# EAGLE design SMPSv2 (EAGLE 6.4)
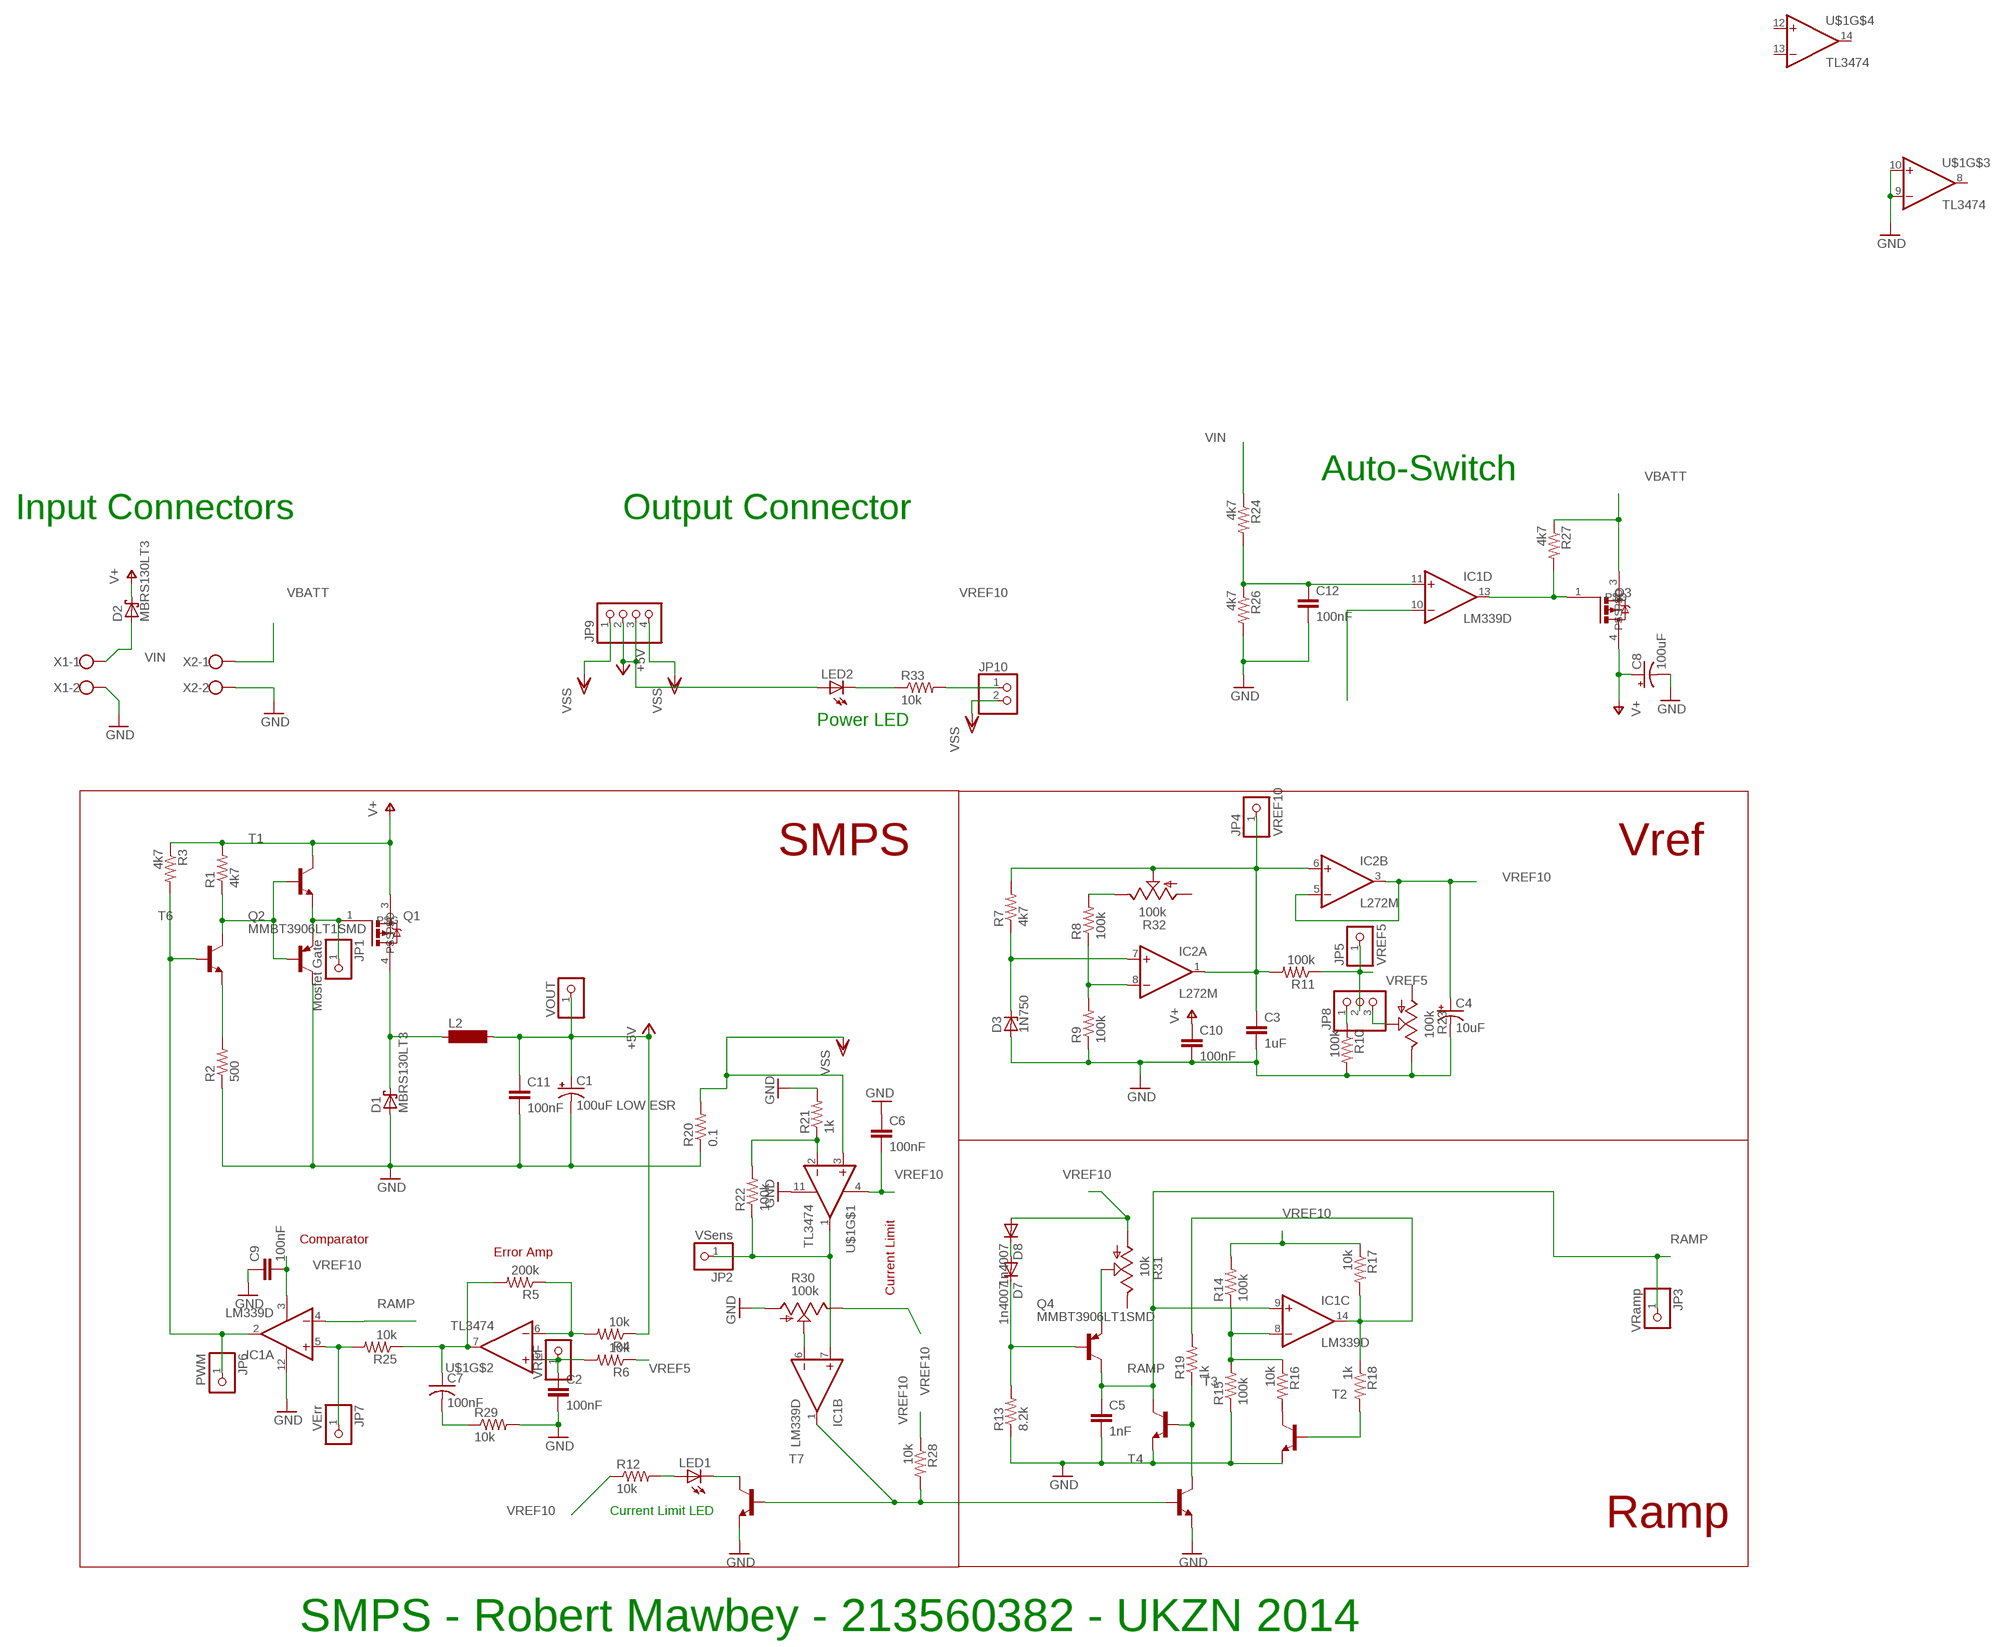
[diagram p0: schematic, sheet 1]

## Parts
C1  100uF LOW ESR  CPOL-USD  [PANASONIC_D]
C2  100nF  C-EUC0805  [C0805]
C3  1uF  C-EUC0805  [C0805]
C4  10uF  CPOL-USE5-10.5  [E5-10,5]
C5  1nF  C-EUC0805  [C0805]
C6  100nF  C-EUC0805  [C0805]
C7  100nF  C-USC0805  [C0805]
C8  100uF  CPOL-USE5-13  [E5-13]
C9  100nF  C-EUC0805  [C0805]
C10  100nF  C-EUC0805  [C0805]
C11  100nF  C-EUC0805  [C0805]
C12  100nF  C-EUC0805  [C0805]
D1  MBRS130LT3  [SMB]
D2  MBRS130LT3  [SMB]
D3  1N750  ZENER-DIODEZD-7.5  [ZDIO-7.5]
D7  1n4007  DIODE-DO-214AC  [DO-214AC]
D8  1n4007  DIODE-DO-214AC  [DO-214AC]
IC1  LM339D  [SO14]
IC2  L272M  [DIL08]
JP1  Mosfet Gate  PINHD-1X1  [1X01]
JP2  VSens  PINHD-1X1  [1X01]
JP3  VRamp  PINHD-1X1  [1X01]
JP4  VREF10  PINHD-1X1  [1X01]
JP5  VREF5  PINHD-1X1  [1X01]
JP6  PWM  PINHD-1X1  [1X01]
JP7  VErr  PINHD-1X1  [1X01]
JP8  PINHD-1X3  [1X03]
JP9  PINHD-1X4  [1X04]
JP10  PINHD-1X2  [1X02]
L2  BS11  [BS11]
LED1  LEDCHIPLED_0805  [CHIPLED_0805]
LED2  LEDCHIPLED_0805  [CHIPLED_0805]
Q1  IRFR9024NDPAK  [D-PAK_TO252AA]
Q2  MMBT3906LT1SMD  [SOT23-BEC]
Q3  IRFR9024NDPAK  [D-PAK_TO252AA]
Q4  MMBT3906LT1SMD  [SOT23-BEC]
R1  4k7  R-US_R0805  [R0805]
R2  500  R-US_R0805  [R0805]
R3  4k7  R-US_R0805  [R0805]
R4  10k  R-US_R0805  [R0805]
R5  200k  R-US_R0805  [R0805]
R6  10k  R-US_R0805  [R0805]
R7  4k7  R-US_R0805  [R0805]
R8  100k  R-US_R0805  [R0805]
R9  100k  R-US_R0805  [R0805]
R10  100k  R-US_R0805  [R0805]
R11  100k  R-US_R0805  [R0805]
R12  10k  R-US_R0805  [R0805]
R13  8.2k  R-US_R0805  [R0805]
R14  100k  R-US_R0805  [R0805]
R15  100k  R-US_R0805  [R0805]
R16  10k  R-US_R0805  [R0805]
R17  10k  R-US_R0805  [R0805]
R18  1k  R-US_R0805  [R0805]
R19  1k  R-US_R0805  [R0805]
R20  0.1  R-US_R1206  [R1206]
R21  1k  R-US_R0805  [R0805]
R22  100k  R-US_R0805  [R0805]
R23  100k  TRIM_US-B25P  [B25P]
R24  4k7  R-US_R0805  [R0805]
R25  10k  R-US_R0805  [R0805]
R26  4k7  R-US_R0805  [R0805]
R27  4k7  R-US_R0805  [R0805]
R28  10k  R-US_R0805  [R0805]
R29  10k  R-US_R0805  [R0805]
R30  100k  TRIM_US-B25P  [B25P]
R31  10k  TRIM_US-B25P  [B25P]
R32  100k  TRIM_US-B25P  [B25P]
R33  10k  R-US_R0805  [R0805]
T1  MMBT2222ALT1-NPN-SOT23-BEC  [SOT23-BEC]
T2  MMBT2222ALT1-NPN-SOT23-BEC  [SOT23-BEC]
T3  MMBT2222ALT1-NPN-SOT23-BEC  [SOT23-BEC]
T4  MMBT2222ALT1-NPN-SOT23-BEC  [SOT23-BEC]
T6  MMBT2222ALT1-NPN-SOT23-BEC  [SOT23-BEC]
T7  MMBT2222ALT1-NPN-SOT23-BEC  [SOT23-BEC]
U$1  TL3474  [SO14]
VOUT  PINHD-1X1  [1X01]
VREF  PINHD-1X1  [1X01]
X1  W237-102  [W237-102]
X2  W237-102  [W237-102]

## Nets
+5V: C1.+ C11.1 JP9.2 JP9.3 L2.2 LED2.A R4.1 VOUT.1
GND: C1.- C2.2 C3.2 C4.- C5.2 C6.1 C8.- C9.1 C10.2 C11.2 C12.2 D1.A D3.A IC1.12(P:GND) Q2.C R2.1 R9.1 R10.2 R13.1 R15.1 R20.1 R21.2 R23.E R26.2 R29.2 R30.A T2.E T3.E T4.E T7.E U$1.9(-IN) U$1.10(+IN) U$1.11(V-) X1.2 X2.2
MSOUT: D1.C L2.1 Q1.4(P$D)
N$1: JP1.1 Q1.1(P$G) Q2.E T1.E
N$2: C7.2 R29.1
N$3: IC1.2(A:OUT) JP6.1 R3.2 T6.B
N$4: C2.1 R6.2 U$1.5(+IN) VREF.1
N$5: Q4.E R31.S
N$6: C12.1 IC1.11(D:+IN) R24.2 R26.1
N$7: C7.1 R5.2 R25.1 U$1.7(OUT)
N$8: D3.C IC2.7(A:+IN) R7.1
N$9: R4.2 R5.1 U$1.6(-IN)
N$10: IC2.8(A:-IN) R8.1 R9.2
N$12: IC1.13(D:OUT) Q3.1(P$G) R27.2
N$13: LED1.C T7.C
N$14: D7.C Q4.B R13.2
N$15: R19.1 T3.B T4.C
N$16: D7.A D8.C
N$17: R16.2 T2.C
N$18: IC1.8(C:-IN) R14.1 R15.2 R16.1
N$19: R21.1 R22.2 U$1.2(-IN)
N$20: R18.2 T2.B
N$21: IC1.6(B:-IN) R30.S
N$22: IC1.7(B:+IN) JP2.1 R22.1 U$1.1(OUT)
N$23: R8.2 R32.E
N$24: IC1.1(B:OUT) R28.2 T4.B T7.B
N$25: IC1.5(A:+IN) JP7.1 R25.2
N$26: LED1.A R12.2
N$27: JP8.3 R23.S
N$28: IC1.14(C:OUT) R17.2 R18.1 R19.2
N$29: Q2.B R1.1 T1.B T6.C
N$30: R2.2 T6.E
N$31: JP8.1 R10.1
N$32: LED2.C R33.1
N$33: JP10.1 R33.2
RAMP: C5.1 IC1.4(A:-IN) IC1.9(C:+IN) JP3.1 Q4.C T3.C
V+: C8.+ C10.1 D2.C Q1.3(P$S) Q3.4(P$D) R1.2 R3.1 T1.C
VBATT: Q3.3(P$S) R27.1 X2.1
VIN: D2.A R24.1 X1.1
VR10: C3.1 IC2.1(A:OUT) IC2.6(B:+IN) JP4.1 R7.2 R11.2 R32.S
VREF5: JP5.1 JP8.2 R6.1 R11.1
VREF10: C4.+ C6.2 C9.2 D8.A IC1.3(P:V+) IC1.10(D:-IN) IC2.3(B:OUT) IC2.5(B:-IN) R12.1 R14.2 R17.1 R28.1 R30.E R31.A U$1.4(V+)
VSS: JP9.1 JP9.4 JP10.2 R20.2 U$1.3(+IN)
Unconnected: R23.A R31.E R32.A U$1.8(OUT) U$1.12(+IN) U$1.13(-IN) U$1.14(OUT)

## Notes on the sheet
- Auto-Switch
- Input Connectors | Output Connector
- Power LED
- SMPS | Vref
- Comparator
- Error Amp
- Current Limit
- Current Limit LED
- Ramp
- SMPS - Robert Mawbey - 213560382 - UKZN 2014

## Power pins joined to a net without a drawn wire
GND: IC2.4(P:GND)
V+: IC2.2(P:V+)

## Library data of the parts
C1 C4 C8 = resistor:CPOL-US: POLARIZED CAPACITOR, American symbol
C2 C3 C5 C6 C9-C12 = resistor:C-EU: CAPACITOR, European symbol
C7 = resistor:C-US: CAPACITOR, American symbol
D1 D2 = diode:MBRS130LT3: Schottky Power Rectifier Source: http://www.onsemi.com/pub/Collateral/MBRS130LT3-D.PDF
D3 = diode:ZENER-DIODE: Z-Diode
D7 D8 = diode:DIODE-: DIODE
IC1 = linear:LM339: Low Power Low Offset Voltage Quad Comparators with open collector; LM139/LM239/LM339/LM2901/LM3302
IC2 = linear:L272: OP AMP
JP1-JP7 VOUT VREF = pinhead:PINHD-1X1: PIN HEADER
JP8 = pinhead:PINHD-1X3: PIN HEADER
JP9 = pinhead:PINHD-1X4: PIN HEADER
JP10 = pinhead:PINHD-1X2: PIN HEADER
L2 = inductor-neosid:BS: INDUCTOR nominal inductance, magnetically screened; OC_FARNELL: unknown; OC_NEWARK: unknown
LED1 LED2 = led:LED: LED OSRAM: - CHIPLED LG R971, LG N971, LY N971, LG Q971, LY Q971, LO R971, LY R971 LH N974, LH R974 LS Q976, LO Q976, LY Q976 LO Q996 - Hyper CHIPLED LW Q18S LB Q993, LB Q99A, LB R99A - SideLED LS A670, LO A670, LY A670, LG A670, LP A670 LB A673, LV A673, LT A673, LW A673 LH A674 LY A675 LS A676, LA A676, LO A676, LY A676, LW A676 LS A679, LY A679, LG A679 - Hyper Micro SIDELED® LS Y876, LA Y876, LO Y876, LY Y876 LT Y87S - SmartLED LW L88C, LW L88S LB L89C, LB L89S, LG L890 LS L89K, LO L89K, LY L89K LS L896, LA L896, LO L896, LY L896 - TOPLED LS T670, LO T670, LY T670, LG T670, LP T670 LSG T670, LSP T670, LSY T670, LOP T670, LYG T670 LG T671, LOG T671, LSG T671 LB T673, LV T673, LT T673, LW T673 LH T674 LS T676, LA T676, LO T676, LY T676, LB T676, LH T676, LSB T676, LW T676 LB T67C, LV T67C, LT T67C, LS T67K, LO T67K, LY T67K, LW E67C LS E67B, LA E67B, LO E67B, LY E67B, LB E67C, LV E67C, LT E67C LW T67C LS T679, LY T679, LG T679 LS T770, LO T770, LY T770, LG T770, LP T770 LB T773, LV T773, LT T773, LW T773 LH T774 LS E675, LA E675, LY E675, LS T675 LS T776, LA T776, LO T776, LY T776, LB T776 LHGB T686 LT T68C, LB T68C - Hyper Mini TOPLED® LB M676 - Mini TOPLED Santana® LG M470 LS M47K, LO M47K, LY M47K Source: http://www.osram.convergy.de LUXEON: - LUMILED® LXK2-PW12-R00, LXK2-PW12-S00, LXK2-PW14-U00, LXK2-PW14-V00 LXK2-PM12-R00, LXK2-PM12-S00, LXK2-PM14-U00 LXK2-PE12-Q00, LXK2-PE12-R00, LXK2-PE12-S00, LXK2-PE14-T00, LXK2-PE14-U00 LXK2-PB12-K00, LXK2-PB12-L00, LXK2-PB12-M00, LXK2-PB14-N00, LXK2-PB14-P00, LXK2-PB14-Q00 LXK2-PR12-L00, LXK2-PR12-M00, LXK2-PR14-Q00, LXK2-PR14-R00 LXK2-PD12-Q00, LXK2-PD12-R00, LXK2-PD12-S00 LXK2-PH12-R00, LXK2-PH12-S00 LXK2-PL12-P00, LXK2-PL12-Q00, LXK2-PL12-R00 Source: www.luxeon.com KINGBRIGHT: KA-3528ASYC Source: www.kingbright.com
Q1 Q3 = RobThePyro:IRFR9024N: http://www.irf.com/product-info/datasheets/data/irfr9024n.pdf
Q2 Q4 = transistor-pnp:MMBT3906*: PNP Transistror
R1-R22 R24-R29 R33 = resistor:R-US_: RESISTOR, American symbol
R23 R30-R32 = pot:TRIM_US-: POTENTIOMETER
T1-T4 T6 T7 = transistor:*-NPN-: NPN Transistror BF959 corrected 2008.03.06
U$1 = linear:TL3474
X1 X2 = con-wago-500:W237-102: WAGO SCREW CLAMP; MPN: 237-102; OC_FARNELL: unknown; OC_NEWARK: 70K9898

## Board
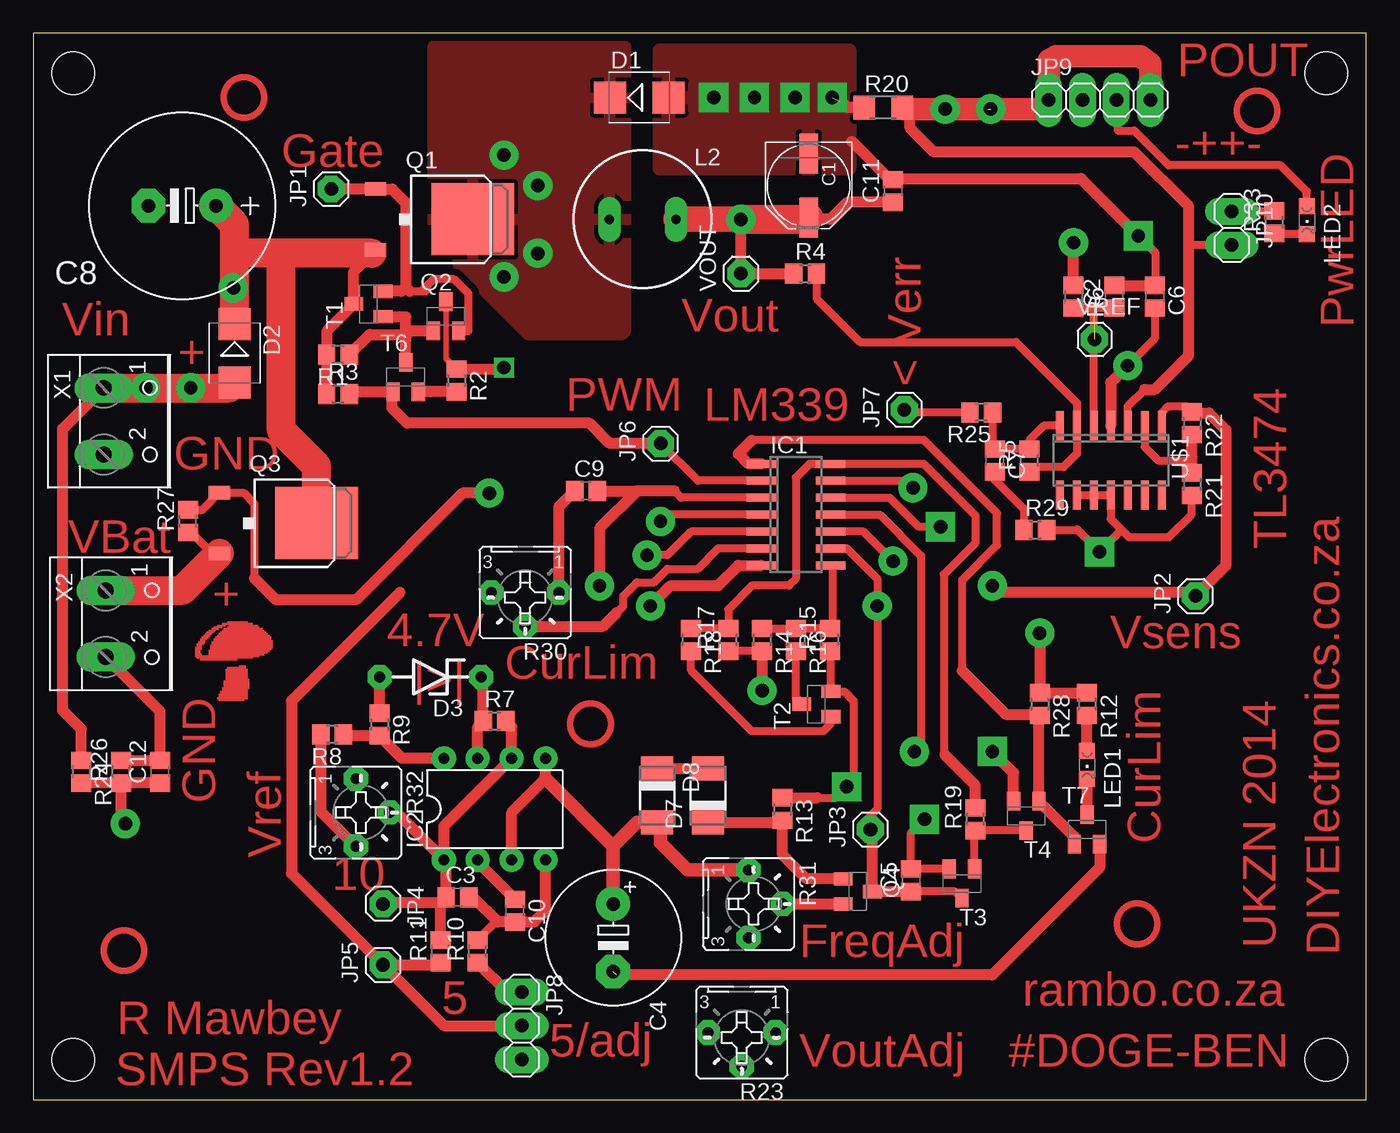
[diagram p1: board, top side]
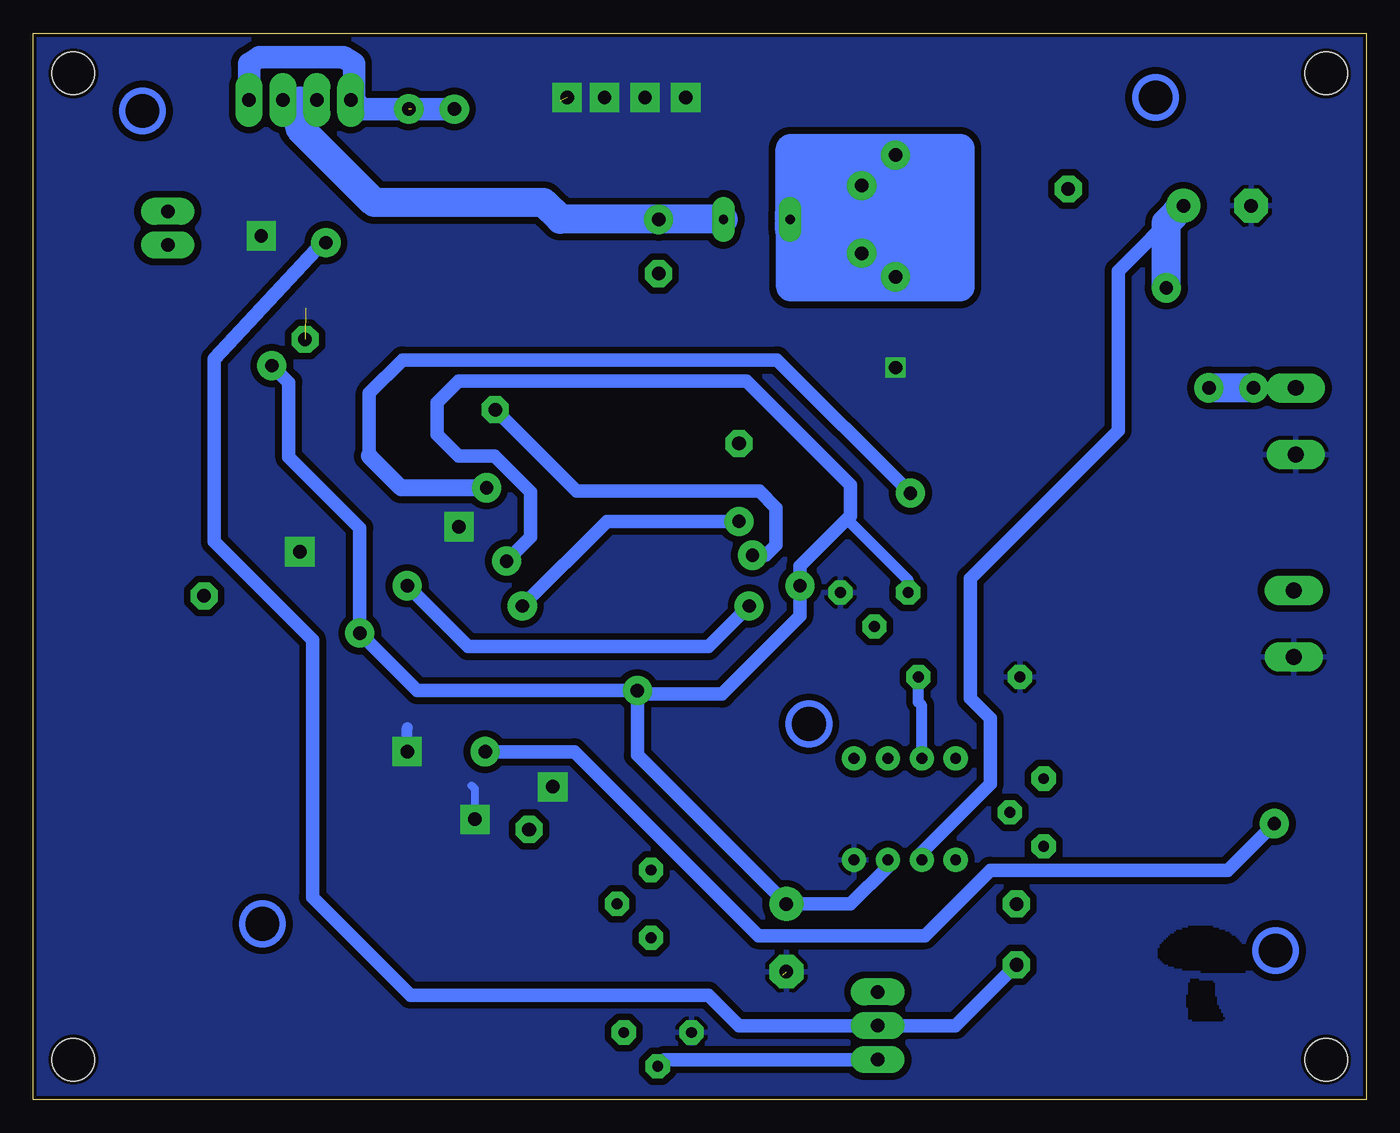
[diagram p2: board, bottom side, seen from below]

Size 100 x 80 mm. Coordinates in mm from the lower left corner, seen from the top.
Outline: 0,0 100,0 100,80 0,80 0,0
Copper layers (1*16): Top 0.035mm / dielectric 1.5mm / Bottom 0.035mm
Design rules "SparkFun *": minimum track width 16mil, minimum drill 0.7mm, track to track 20mil, track to pad 12mil, pad to pad 12mil, via to via 10mil, smd to smd 12mil, copper to edge 10mil, drill to drill 8mil, minimum pad ring 0.5mm, minimum via ring 10mil, stop-mask expansion 4mil, vias tented up to drill 25mil, thermal gap 12mil
Holes 3.2 mm at 3,3 97,3 97,77 3,77
bRestrict: area 10.7,5.9 to 13,6; area 10.6,6 to 13.3,6.2; area 10.7,6.2 to 13.3,6.3; area 10.7,6.3 to 13.3,6.5; area 10.9,6.5 to 13.3,6.6; area 10.9,6.6 to 13.3,6.8; area 11,6.8 to 13.3,6.9; area 11,6.9 to 13.5,7.1; area 11.2,7.1 to 13.5,7.2; area 11.2,7.2 to 13.5,7.4; area 11.2,7.4 to 13.5,7.5; area 11.2,7.5 to 13.5,7.7; 50 more areas

### Footprints (pad centres in the part's own frame; a part is rotated, then mirrored left to right if it is on the bottom)
PANASONIC_D = smd 3 x 1.4: + 2.4,0; - -2.4,0
C0805 = smd 1.3 x 1.5: 1 -0.85,0; 2 0.85,0
E5-10,5 = drill 1.016 pad 2.54: + -2.54,0 | drill 1.016 pad 2.54 octagon: - 2.54,0
E5-13 = drill 1.016 pad 2.54: + -2.54,0 | drill 1.016 pad 2.54 octagon: - 2.54,0
SMB = smd 2.4 x 2.4: A 2.2,0; C -2.2,0
ZDIO-7.5 = drill 0.813 octagon: A 3.81,0; C -3.81,0
DO-214AC = smd 1.8 x 2.4: A 2.025,0; C -2.025,0
SO14 = smd 0.6 x 2.2: 1 -3.81,-2.6; 2 -2.54,-2.6; 3 -1.27,-2.6; 4 0,-2.6; 5 1.27,-2.6; 6 2.54,-2.6; 7 3.81,-2.6; 8 3.81,2.6; 9 2.54,2.6; 10 1.27,2.6; 11 0,2.6; 12 -1.27,2.6; 13 -2.54,2.6; 14 -3.81,2.6
DIL08 = drill 0.813 pad 1.27: 1 -3.81,-3.81; 2 -1.27,-3.81; 3 1.27,-3.81; 4 3.81,-3.81; 5 3.81,3.81; 6 1.27,3.81; 7 -1.27,3.81; 8 -3.81,3.81
1X01 = drill 1.016 octagon: 1 0,0
1X03 = drill 1.016 long: 1 -2.54,0; 2 0,0; 3 2.54,0
1X04 = drill 1.016 long: 1 -3.81,0; 2 -1.27,0; 3 1.27,0; 4 3.81,0
1X02 = drill 1.016 long: 1 -1.27,0; 2 1.27,0
BS11 = drill 0.7 long: 1 -2.5,0; 2 2.5,0
CHIPLED_0805 = smd 1.2 x 1.2: A 0,-1.05; C 0,1.05
D-PAK_TO252AA = smd 1 x 1.6: 1 -2.28,-4.8; 3 2.28,-4.8 | smd 5.4 x 6.2: 4 0,2.5
SOT23-BEC = smd 1 x 1.4: B -0.95,-1.1; C 0,1.1; E 0.95,-1.1
R0805 = smd 1.3 x 1.5: 1 -0.85,0; 2 0.85,0
R1206 = smd 1.6 x 1.803: 1 -1.422,0; 2 1.422,0
B25P = drill 0.813 octagon: A -2.54,0; E 2.54,0; S 0,2.54
W237-102 = drill 1.194 long: 1 -2.5,-1.27; 2 2.5,-1.27

### Placement (x,y rotation side)
C1  58.17,68.58 270 top
C2  81.09,60.24 90 top
C3  31.82,15.19 0 top
C4  43.5,12.14 270 top
C5  65.85,16.46 90 top
C6  84.14,60.24 270 top
C7  72.13,47.95 270 top
C8  11.18,67.06 180 top
C9  41.47,45.67 0 top
C10  36.14,14.17 270 top
C11  64.5,68.17 90 top
C12  9.5,24.6 90 top
D1  45.47,75.18 0 top
D2  15.1,56 270 top
D3  29.79,31.7 180 top
D7  50.61,22.81 90 top
D8  46.8,22.81 270 top
IC1  57.22,43.89 270 top
IC2  34.61,21.79 0 top
JP1  22.35,68.33 90 top
JP2  87.19,37.79 90 top
JP3  62.81,20.27 90 top
JP4  26.23,14.68 270 top
JP5  26.23,10.11 90 top
JP6  47.06,49.22 90 top
JP7  65.35,51.76 90 top
JP8  36.64,5.53 270 top
JP9  80,75 0 top
JP10  89.92,65.38 270 top
L2  45.72,66.04 0 top
LED1  79.06,25.09 180 top
LED2  95.55,65.99 180 top
Q1  30.48,66.04 270 top
Q2  30.95,58.77 0 top
Q3  18.75,43.25 270 top
Q4  61.86,15.61 270 top
R1  22.86,55.88 180 top
R2  31.75,53.96 270 top
R3  22.86,52.94 0 top
R4  57.91,61.98 0 top
R5  74.74,47.95 90 top
R6  78.05,60.24 270 top
R7  34.61,28.39 0 top
R8  22.42,27.38 180 top
R9  25.98,28.14 270 top
R10  33.34,11.12 90 top
R11  30.55,11.12 90 top
R12  79.06,29.66 270 top
R13  56.2,21.79 270 top
R14  54.68,34.49 270 top
R15  59.76,34.49 90 top
R16  57.22,34.49 270 top
R17  52.14,34.49 90 top
R18  49.34,34.49 270 top
R19  70.68,21.03 90 top
R20  63.75,74.42 0 top
R21  86.94,46.17 270 top
R22  86.94,50.75 270 top
R23  53.15,5.03 180 top
R24  3.6,24.6 270 top
R25  71.12,51.56 180 top
R26  6.6,24.6 90 top
R27  11.6,43.4 90 top
R28  75.51,29.66 270 top
R29  75.17,42.73 0 top
R30  36.9,38.05 180 top
R31  53.66,14.68 270 top
R32  24.2,21.54 270 top
R33  93.12,65.84 90 top
T1  25.15,59.69 90 top
T2  58.74,29.66 90 top
T3  69.66,16.2 180 top
T4  74.49,21.28 180 top
T6  27.94,54.21 0 top
T7  79.06,20.27 0 top
U$1  80.84,47.95 180 top
VOUT  53.09,61.98 90 top
VREF  79.62,57.04 0 top
X1  6.55,50.9 270 top
X2  6.7,35.7 270 top

### Tracks (layer width: path | path; a pad name or v marks a point on that pad's centre or on a via)
+5V  (via drill 1 pad 2.18)
  Top 0.61: LED2.A 95.56,68.12 93.57,70.1 85.19,70.1 82.6,72.69 81.38,72.69 81.38,74.89 JP9.3
  Top 0.813: v53.09,66.04 VOUT.1 R4.1 | C11.1 61.08,67.32 59.8,66.04 58.31,66.04 C1.+
  Top 1.93: L2.2 v53.09,66.04 54.61,66.04
  Top 2.184: v53.09,66.04 58.03,66.04 C1.+
  Bottom 0.61: JP9.3 80.08,75 80.01,74.93
  Bottom 1.016: 80.01,74.93 78.8,74.93 JP9.2
  Bottom 2.184: L2.2 v53.09,66.04 60.45,66.04 61.72,67.31 74.42,67.31 80.01,72.9 80.01,74.93
GND  (via drill 1, 1 pad 2.18)  (2 unrouted)
  Top 0.406: Q2.C 30.95,55.61 R2.1
  Top 0.61: R15.1 59.84,33.56 T2.E 60.84,30.61 61.54,29.92 61.54,23.97 v61.03,23.47 60.2,22.64 58.83,22.64 | C6.1 C2.2 | C5.2 T3.E 65.94,17.3 65.85,17.22 65.85,20.01 v66.87,21.03 | U$1.9 U$1.10 U$1.11 80.84,43.56 81.6,42.8 | 81.6,42.8 82.2,42.2 85.2,42.2 86.9,43.9 86.9,45.29 R21.2 | 81.6,42.8 81.6,42.7 v80,41.1 78.32,42.78 78.27,42.73 R29.2 | 84.2,61.1 84.2,63.5 v82.9,64.8 | IC1.12 64.24,45.16 66.4,43 68.04,43 v68.07,42.97 | R10.2 34.69,13.32
  Top 0.813: R9.1 D3.A | T4.E 73.54,24.52 v71.95,26.11 | R13.1 58.83,22.64 | IC2.4 38.42,14.17 37.57,13.32 C10.2 34.87,13.32 | 34.87,13.32 34.69,13.32 | C3.2 33,15.19 34.87,13.32 | R30.A 39.44,44.48 C9.1 | T7.E 80.01,17.41 71.95,9.34 43.76,9.34 | 61.4,71.9 64.28,69.02 C11.2 64.58,69.1 78.6,69.1 v82.9,64.8 | C2.2 84.19,61.09 84.2,61.1 | R20.1 61.08,74.42 60.6,74.9 60.5,74.9 | 31.58,54.81 R2.1 35.31,54.81 v35.31,54.92 | R26.2 C12.2 9.5,29.13 X2.2
  Bottom 0.61: v66.87,21.03 66.87,23.31 67.12,23.57 | v80,41.1 79.9,41.1 | v82.9,64.8 83,64.8 83.1,64.9
  Bottom 0.813: v71.95,26.11 71.95,27.89
  other vias: 51.05,75.18 51.05,75.18 54.1,75.18 57.15,75.18 59.94,75.18
  pour Bottom: 0,80.01 0,0 100.08,0 100.08,80.01
  pour Top: 54.86,78.74 46.99,78.74 46.99,69.85 61.21,69.85 61.21,78.74
MSOUT  (via drill 1 pad 2.18)
  Bottom 2.184: L2.1 43.22,71.33 43.18,71.37 30.48,71.37 30.48,60.96 43.18,60.96 43.18,66.29 41.15,66.29
  Bottom 6.452: 41.15,66.29 41.15,65.53 39.88,64.26 33.53,64.26 33.53,68.07 33.27,68.33 40.39,68.33 40.89,68.83
  other vias: 35.31,61.72 35.31,70.87 35.31,70.87 35.31,70.87 37.85,68.58 37.85,63.5
  pour Top: 29.97,78.99 29.97,63.25 31.24,63.25 37.08,57.4 44.2,57.4 44.45,57.66 44.45,78.99
N$1
  Top 0.61: 28.26,60.64 29.12,60.64 | 29.12,60.64 29.46,60.64 | Q2.E 32.64,57.67 32.64,60.47 31.56,61.55 30.03,61.55 29.12,60.64
  Top 0.813: 27.94,60.96 27.94,67.31 26.93,68.32 Q1.1 JP1.1 | 27.94,60.96 28.26,60.64 | 27.94,60.96 27.62,60.64 T1.E
N$2
  Top 0.61: C7.2 72.13,46.47 74.3,44.3 74.3,42.75 R29.1
N$3
  Top 0.61: IC1.2 49.85,46.43 JP6.1
  Top 0.813: R3.2 23.88,53.11 T6.B | JP6.1 43.25,49.22 41.72,50.75 28.05,50.75 26.9,51.9 26.9,53.02 T6.B | 26.92,53.04 T6.B
N$4  (1 unrouted)
  Top 0.61: R6.2 79.57,59.39 | U$1.5 79.57,59.39 | C2.1 79.57,59.39
N$5
  Top 0.813: Q4.E 56.22,14.66 R31.S
  Bottom 1.016: R31.S
N$6  (via drill 1 pad 2.18)
  Top 0.61: IC1.11 63.51,43.89 66.6,40.8 66.6,26.6 v66.1,26.1
  Top 0.813: R26.1 R24.2 | C12.1 R26.1 | v6.9,20.7 6.7,20.9 6.7,21 6.6,21.1 R26.1
  Bottom 1.016: v66.1,26.1 59.4,26.1 45.6,12.3 33.1,12.3 28.2,17.2 10.4,17.2 v6.9,20.7
N$7
  Top 0.61: U$1.7 75.82,50.55 74.74,49.48 R5.2 C7.1 71.97,48.97 R25.1
N$8
  Top 0.813: IC2.7 33.34,27.97 R7.1 33.76,31.53 D3.C
  Bottom 0.813: IC2.7 33.34,29.56 33.6,29.82 33.6,31.72
N$9
  Top 0.61: U$1.6 78.3,52.27 73.72,56.84 62.03,56.84 58.76,60.11 R4.2 | U$1.6 78.3,49.98 | U$1.6 78.3,48.46 77.28,47.44 75.09,47.44 R5.1
N$10
  Top 0.813: IC2.8 27.67,25.6 R9.2 23.36,27.29 R8.1
N$12  (via drill 1 pad 2.18)
  Top 0.61: R27.2 12.67,44.25 Q3.1 13.98,45.5 15.8,45.5 16.6,44.7 16.6,39.1 | IC1.13 65.47,46.43 v66,45.9
  Top 0.813: v34.2,45.5 32.2,45.5 24.2,37.5 18.2,37.5 16.6,39.1
  Bottom 1.016: v34.2,45.5 44.2,55.5 72.3,55.5 74.8,53 74.8,48.3
  Bottom 1.27: v66,45.9 72.4,45.9 74.8,48.3
N$13
  Top 0.813: LED1.C T7.C
N$14
  Top 0.61: 56,20.74 R13.2
  Top 0.813: D7.C 56.04,20.78 R13.2 | R13.2 56.39,20.94 | Q4.B 58.01,16.56 56.21,18.36 R13.2
N$15
  Top 0.61: T3.B 70.61,20.11 R19.1 T4.C
N$16
  Top 0.813: D8.C D7.A
N$17
  Top 0.61: T2.C 57.64,29.75 57.22,30.17 R16.2
N$18
  Top 0.61: R16.1 R15.2 R14.1 59.85,35.34 60.01,35.51 60.01,39.88 IC1.8
N$19
  Top 0.61: U$1.2 83.38,48.97 84.4,47.95 86.68,47.95 86.94,48.21
  Top 0.813: R21.1 86.94,48.21 R22.2
N$20
  Top 0.61: T2.B 59.84,28.22 59.25,27.63 53.92,27.63 49.34,32.2 R18.2
N$21
  Top 0.61: IC1.6 51.38,41.35 49.85,39.82 47.57,39.82 46.55,38.81 45.28,38.81 44.26,37.79 44.26,37.03 43.76,36.52
  Top 0.813: R30.S 42.74,35.51 43.76,36.52
N$22  (via drill 1 pad 2.18)
  Top 0.61: U$1.1 84.65,51.51 85.16,52.02 86.52,52.02 R22.1 87.02,51.51
  Top 0.813: 87.02,51.51 88.21,51.51 89.48,50.24 89.48,40.08 87.44,38.05 | 87.44,38.05 JP2.1 | 87.44,38.05 72.46,38.05 v71.95,38.55 | v46.3,37.03 47.82,38.55 51.38,38.55 52.9,40.08 IC1.7
  Bottom 1.016: v71.95,38.55 67.38,33.98 49.34,33.98 v46.3,37.03
N$23
  Top 0.813: R8.2 21.57,21.62 R32.E
N$24
  Top 0.61: 69.7,32.17 69.7,39 72.3,41.6 72.3,44 66.8,49.5 53.94,49.5 53.92,49.48
  Top 0.813: IC1.1 53.66,47.7 52.9,48.46 53.92,49.48 | T7.B 78.11,19.71 T4.B 75.44,28.75 R28.2 75.42,28.9 72.97,28.9 69.7,32.17
N$25  (via drill 1 pad 2.18)
  Top 0.61: IC1.5 49.34,42.62 47.57,40.84 v46.04,40.84 | R25.2 65.55,51.56 JP7.1
  Bottom 1.016: JP7.1 59.25,45.67 45.53,45.67 44.26,44.4 44.26,41.6 45.03,40.84 v46.04,40.84
N$26
  Top 0.813: LED1.A R12.2
N$27
  Bottom 1.016: JP8.3 52.65,2.99 R23.S
N$28
  Top 0.61: IC1.14 58.23,47.7 57.22,46.68 57.22,39.06 56.71,38.55 53.92,38.55 52.14,36.78 R17.2 R18.1 | IC1.14 | 68.62,25.62 68.3,25.95 68.3,39.4 70.7,41.8 70.7,43.8 66.8,47.7 IC1.14
  Top 0.813: R19.2 70.68,23.57 68.62,25.62 68.4,25.85
N$29
  Top 0.61: 28.04,56.9 27.94,57
  Top 0.813: T1.B 27.94,58.74 27.94,57.4 | T6.C 27.94,57 28,57.67 | 28,57.67 27.94,57.4 | R1.1 25.23,57.4 27.94,57.4 | Q2.B 28,57.67
N$30
  Top 0.813: R2.2 29.8,53.11 T6.E
N$31
  Top 0.813: JP8.1 35.54,8.07 R10.1
N$32
  Top 0.61: R33.1 95.51,64.99 LED2.C
N$33
  Top 0.61: JP10.1 93.08,66.65 R33.2
RAMP  (via drill 1 pad 2.18)
  Top 0.61: T3.C 69.16,15.61 C5.1 | IC1.9 61.03,41.35 63.31,39.06 v63.31,37.03 | IC1.4 47.57,43.89 v47.06,43.38 | 62.81,37.03 63.31,36.52 63.31,21.79 62.81,21.28 JP3.1
  Top 0.813: C5.1 Q4.C 62.96,20.11 JP3.1
  Top 1.016: v63.31,37.03 62.81,37.03
  Bottom 1.016: v47.06,43.38 56.96,43.38 v63.31,37.03
V+  (via drill 1 pad 2.18)
  Top 0.813: R3.1 R1.2 22.01,57.65 T1.C 24.05,62.13 25.41,63.49 Q1.3 | IC2.2 33.34,17.81 C10.1
  Top 2.184: D2.C 15.1,63.3 | 15.1,63.3 15.1,65.67 C8.+ | 25.41,63.49 18.7,63.49 | 18.7,63.49 15.29,63.49 15.1,63.3 | Q3.4 21.25,47.55 18.6,50.2 18.6,63.39 18.7,63.49
  Bottom 1.016: IC2.2 33.34,18.56 28.2,23.7 28.2,28.6 29.7,30.1 29.7,39.1 18.6,50.2 18.6,62.17 C8.+
  Bottom 2.184: v15,60.9 15,65.77 C8.+
VBATT
  Top 0.61: R27.1 11.85,42.55 14,40.4 14,40.92 Q3.3
  Top 2.184: X2.1 11.18,38.2 Q3.3
VIN  (via drill 1 pad 2.18)
  Top 0.813: R24.1 3.6,27.8 2.2,29.2 2.2,50.32 X1.1
  Top 2.184: X1.1 v8.44,53.4 v11.8,53.4 14.7,53.4 D2.A
  Bottom 2.184: v8.44,53.4 v11.8,53.4
VR10
  Top 0.813: R7.2 35.88,27.97 IC2.6 30.8,20.52 IC2.1 | R32.S 27.25,21.54 IC2.1 | R11.2 30.55,14.77 | 30.55,14.77 C3.1 30.97,17.81 IC2.1 | 30.55,14.77 26.32,14.77 JP4.1
VREF5  (via drill 1 pad 2.18)
  Top 0.813: JP5.1 30.38,10.11 R11.1 | R6.1 v78.05,64.3 | 27.5,38.05 19.37,29.92 19.37,16.96 JP5.1 | JP5.1 30.8,5.53 JP8.2
  Bottom 1.016: v78.05,64.3 78.3,64.3 86.43,55.57 86.43,41.86 79.06,34.49 79.06,15.19 71.7,7.82 49.34,7.82 47.06,5.53 JP8.2 30.8,5.53 JP5.1
VREF10  (via drill 1 pad 2.18)
  Top 0.61: R14.2 R17.1 | IC1.3 48.58,45.16 48.07,45.67 | C6.2 84.14,57.1 v82.11,55.06 | v64.5,40.4 62.28,42.62 IC1.10
  Top 0.813: IC2.3 35.88,21.54 38.42,24.08 IC2.5 | R14.2 v54.68,30.68 | v75.51,35 R28.1 R12.1 | v82.11,55.06 80.84,53.79 U$1.4 | 48.07,45.67 45.28,45.67 | 45.28,45.67 42.49,42.87 v42.49,38.55 | C9.2 45.28,45.67
  Top 1.016: C4.+ 43.5,19 | 43.5,19 38.42,24.08 | 43.5,19 45.29,20.78 D8.A 47.06,20.53 47.06,19.25 49.09,17.22 R31.A
  Bottom 0.813: R30.E 34.36,38.95 38.95,43.55
  Bottom 1.016: IC2.3 35.88,17.47 38.68,14.68 C4.+ 54.68,25.85 v54.68,30.68 | v82.11,55.06 80.84,53.79 80.84,48.21 75.51,42.87 v75.51,35 71.19,30.68 v54.68,30.68 | v54.68,30.68 54.42,30.43 48.33,30.43 42.49,36.27 v42.49,38.55 42.49,40.01 38.95,43.55 38.7,43.8 38.7,46.1 46.5,53.9 68.1,53.9 69.7,52.3 69.7,49.9 68.1,48.3 65.4,48.3 62.7,45.6 62.7,42.2 v64.5,40.4
  other vias: 43.5,14.68
VSS  (via drill 1 pad 2.18)  (1 unrouted)
  Top 0.61: U$1.3 82.11,52.02 83.38,53.29 | 65.28,74.32 R20.2 | JP10.2 86.89,64.11 86.68,64.31
  Top 0.813: 83.38,53.29 84.14,53.29 86.68,55.83 86.68,64.31 86.68,67.02 82.6,71.1 67.58,71.1 65.79,72.9 65.79,73.81 R20.2 | 71.88,74.07 71.63,74.32
  Top 1.676: 65.28,74.32 v68.41,74.32 71.63,74.32 75.51,74.32 JP9.1 76.19,77.97 76.71,78.29 83.06,78.29 83.82,77.72 JP9.4
  Bottom 1.676: v68.41,74.32 75.34,74.32 75.95,74.93 75.95,77.72 76.71,78.19 83.06,78.19 83.82,77.72 83.82,74.93
  other vias: 71.83,74.32
(copper drawn outside any net)
  shapes: Bottom circle x5, Top area x62, Top circle x5

### Text on the board
Top: POUT | -++- | Gate | Vout | PwrLED | Vin | + | < Verr | PWM | LM339 | GND | VBat | TL3474 | + | 4.7V | Vsens | CurLim | GND | |>| | CurLim | Vref | 10 | FreqAdj | UKZN 2014 | DIYElectronics.co.za | rambo.co.za | 5 | R Mawbey | 5/adj | VoutAdj | #DOGE-BEN | SMPS Rev1.2